# Altium project ZLS_MCU_New.PrjPCB (part 1 of 4)
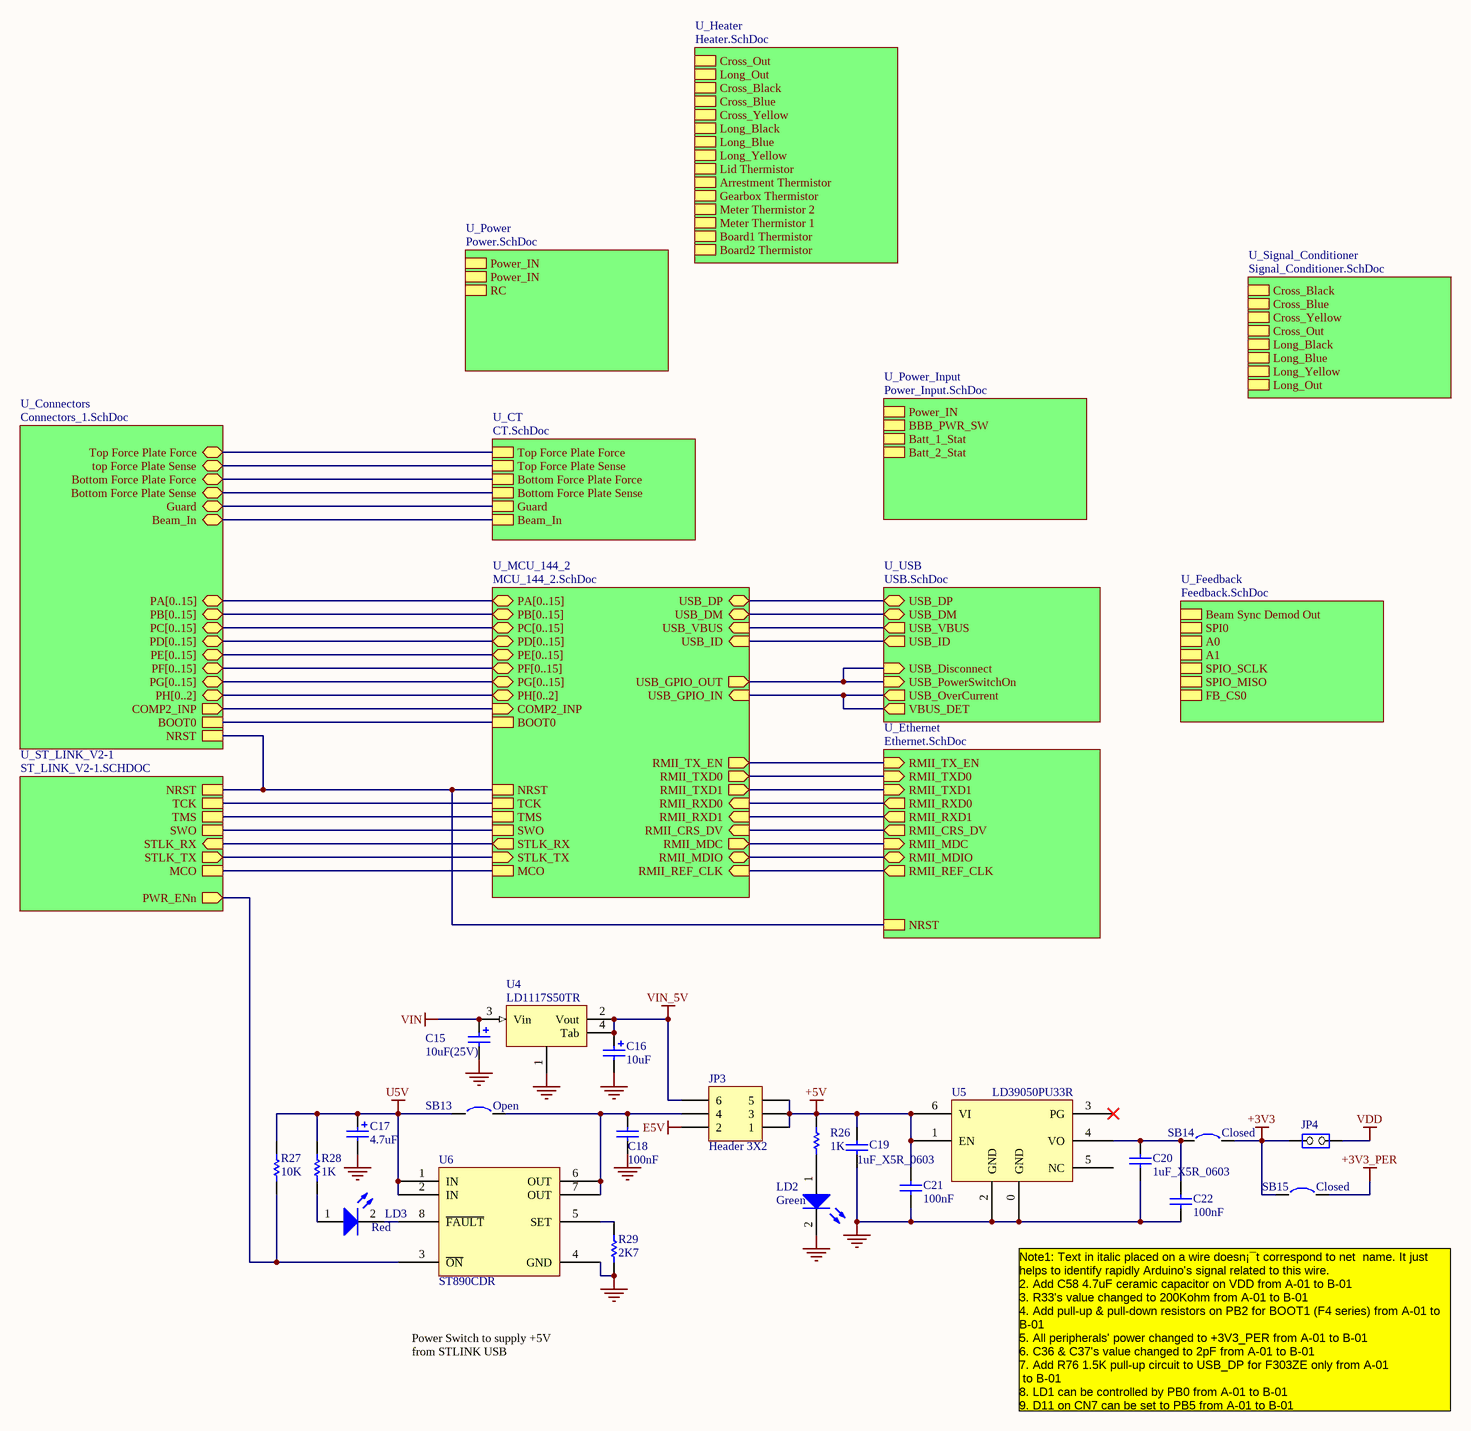
[diagram p0: Top.SchDoc]
11 sheets, 433 parts. Net scope: hierarchical (ports join the sheet entries above them; power ports are global).
Board file: ZLS_MCU.PcbDoc
Sheets:
  Top.SchDoc
    U_Connectors = Connectors_1.SchDoc
    U_MCU_144_2 = MCU_144_2.SchDoc
    U_Feedback = Feedback.SchDoc
    U_Power = Power.SchDoc
    U_Power_Input = Power_Input.SchDoc
    U_Signal_Conditioner = Signal_Conditioner.SchDoc
    U_Heater = Heater.SchDoc
    U_CT = CT.SchDoc
  Copy of USB.SchDoc
  Copy of ST_LINK_V2-1.SCHDOC

## Sheet Top.SchDoc: TOP & POWER
size Tabloid; DocumentNumber: MB1137; Revision: B-01; SheetNumber: 1; SheetTotal: 6; Project: NUCLEO-XXXXZX

### Parts
C15  10uF(25V)  [TAN-B]
C16  10uF  [TAN-A]
C17  4.7uF  [TAN-A]
C18  100nF  [0603C]
C19  1uF_X5R_0603  [0603C]
C20  1uF_X5R_0603  [0603C]
C21  100nF  [0603C]
C22  100nF  [0603C]
JP3  Header 3X2  [HDR_3x2_2R54_V_M]
JP4  (no value)  [HDR_1x2_2R54_V_M_S]
LD2  Green  [0603D-G]
LD3  Red  [0603D-R]
R26  1K  [0603R]
R27  10K  [0603R]
R28  1K  [0603R]
R29  2K7  [0603R]
SB13  Open  [SB_0603]
SB14  Closed  [SB_0603]
SB15  Closed  [SB_0603]
U4  LD1117S50TR  [SOT-223]
U5  LD39050PU33R  [DFN6_0R95_3x3_TP]
U6  ST890CDR  [SOIC8_1R27_4R9X6]

### Sub-sheets
U_Connectors = Connectors_1.SchDoc: PA[0..15] (bidir), PB[0..15] (bidir), PC[0..15] (bidir), NRST, BOOT0, PD[0..15] (bidir), PE[0..15] (bidir), PF[0..15] (bidir), PG[0..15] (bidir), PH[0..2] (bidir), COMP2_INP (out), Top Force Plate Force, top Force Plate Sense, Bottom Force Plate Force, Bottom Force Plate Sense, Guard, Beam_In
U_CT = CT.SchDoc: Top Force Plate Force, Top Force Plate Sense, Bottom Force Plate Force, Bottom Force Plate Sense, Guard, Beam_In
U_Ethernet = Ethernet.SchDoc (file not in this document): RMII_TXD0 (in), RMII_TX_EN (in), RMII_RXD0 (out), RMII_REF_CLK (out), RMII_CRS_DV (out), RMII_MDC (in), RMII_MDIO (bidir), NRST, RMII_TXD1 (in), RMII_RXD1 (out)
U_Feedback = Feedback.SchDoc: Beam Sync Demod Out, SPI0 (harness SPI0), A0, A1, SPIO_SCLK, SPIO_MISO, FB_CS0
U_Heater = Heater.SchDoc: Cross_Out, Long_Out, Cross_Black, Cross_Blue, Cross_Yellow, Long_Black, Long_Blue, Long_Yellow, Lid Thermistor, Arrestment Thermistor, Gearbox Thermistor, Meter Thermistor 2, Meter Thermistor 1, Board1 Thermistor, Board2 Thermistor
U_MCU_144_2 = MCU_144_2.SchDoc: NRST, MCO, STLK_TX (in), STLK_RX (out), PA[0..15] (bidir), PB[0..15] (bidir), PC[0..15] (bidir), TCK, TMS, SWO, BOOT0, PD[0..15] (bidir), PE[0..15] (bidir), PF[0..15] (bidir), PG[0..15] (bidir), PH[0..2] (bidir), USB_DM (bidir), USB_DP (bidir), USB_GPIO_OUT (out), USB_GPIO_IN (in), USB_ID (in), USB_VBUS (in), RMII_TXD0 (out), RMII_TX_EN (out), RMII_RXD0 (in), RMII_REF_CLK (in), RMII_CRS_DV (in), RMII_MDC (out), RMII_MDIO (bidir), RMII_TXD1 (out), RMII_RXD1 (in), COMP2_INP (in)
U_Power = Power.SchDoc: Power_IN, Power_IN, RC
U_Power_Input = Power_Input.SchDoc: Power_IN, BBB_PWR_SW, Batt_1_Stat, Batt_2_Stat
U_Signal_Conditioner = Signal_Conditioner.SchDoc: Cross_Black, Cross_Blue, Cross_Yellow, Cross_Out, Long_Black, Long_Blue, Long_Yellow, Long_Out
U_ST_LINK_V2-1 = ST_LINK_V2-1.SCHDOC (file not in this document): TMS, TCK, MCO, NRST, STLK_RX (in), STLK_TX (out), SWO, PWR_ENn (out)
U_USB = USB.SchDoc (file not in this document): USB_PowerSwitchOn (in), USB_OverCurrent (out), USB_DM (bidir), USB_DP (bidir), USB_ID (out), USB_VBUS (out), USB_Disconnect (in), VBUS_DET (out)

### Nets
+3V3: JP4.1(COMMON) SB14.2 SB15.1
+3V3_PER: SB15.2
+5V: C19.1 C21.2 JP3.1 JP3.3 JP3.5 R26.2 U5.1(EN) U5.6(VI)
E5V: JP3.2
GND: C15.2 C16.2 C17.2 C18.1 C19.2 C20.2 C21.1 C22.1 LD2.2(K) R29.1 U4.1 U5.0(GND) U5.2(GND) U6.4(GND)
U5V: C17.1 R27.1 R28.1 SB13.1 U6.1(IN) U6.2(IN)
VDD: JP4.2(NO)
VIN: C15.1 U4.3(Vin)
VIN_5V: C16.1 JP3.6 U4.2(Vout) U4.4(Tab)
Beam_In: sheet U_Connectors/Beam_In, sheet U_CT/Beam_In
BOOT0: sheet U_Connectors/BOOT0, sheet U_MCU_144_2/BOOT0
NRST: sheet U_Connectors/NRST, sheet U_ST_LINK_V2-1/NRST, sheet U_Ethernet/NRST, sheet U_MCU_144_2/NRST
PA13: sheet U_ST_LINK_V2-1/TMS, sheet U_MCU_144_2/TMS
PA14: sheet U_ST_LINK_V2-1/TCK, sheet U_MCU_144_2/TCK
PB3: sheet U_ST_LINK_V2-1/SWO, sheet U_MCU_144_2/SWO
PG6: sheet U_MCU_144_2/USB_GPIO_OUT, sheet U_USB/USB_PowerSwitchOn, sheet U_USB/USB_Disconnect
NetC18_2: C18.2 JP3.4 SB13.2 U6.6(OUT) U6.7(OUT)
NetC20_1: C20.1 C22.2 SB14.1 U5.4(VO)
NetC77_2: sheet U_Power/Power_IN, sheet U_Power/Power_IN
NetJ1_1: sheet U_Connectors/Top Force Plate Force, sheet U_CT/Top Force Plate Force
NetJ1_2: sheet U_Connectors/top Force Plate Sense, sheet U_CT/Top Force Plate Sense
NetJ1_3: sheet U_Connectors/Bottom Force Plate Force, sheet U_CT/Bottom Force Plate Force
NetJ1_4: sheet U_Connectors/Bottom Force Plate Sense, sheet U_CT/Bottom Force Plate Sense
NetJ1_9: sheet U_Connectors/Guard, sheet U_CT/Guard
NetJP41_2: sheet U_Connectors/COMP2_INP, sheet U_Ethernet/RMII_CRS_DV, sheet U_MCU_144_2/RMII_CRS_DV, sheet U_MCU_144_2/COMP2_INP
NetJP42_1: sheet U_Ethernet/RMII_TXD1, sheet U_MCU_144_2/RMII_TXD1
NetJP43_1: sheet U_MCU_144_2/USB_GPIO_IN, sheet U_USB/USB_OverCurrent, sheet U_USB/VBUS_DET
NetLD2_1: LD2.1(A) R26.1
NetLD3_1: LD3.1(A) R28.2
NetLD3_2: LD3.2(K) U6.8(~{FAULT})
NetR27_2: R27.2 U6.3(~{ON}) ; sheet U_ST_LINK_V2-1/PWR_ENn
NetR29_2: R29.2 U6.5(SET)
NetR46_1: sheet U_MCU_144_2/USB_VBUS, sheet U_USB/USB_VBUS
NetSB56_1: sheet U_Ethernet/RMII_REF_CLK, sheet U_MCU_144_2/RMII_REF_CLK
NetSB58_1: sheet U_Ethernet/RMII_MDIO, sheet U_MCU_144_2/RMII_MDIO
NetSB61_1: sheet U_ST_LINK_V2-1/STLK_RX, sheet U_MCU_144_2/STLK_RX
NetSB63_1: sheet U_ST_LINK_V2-1/STLK_TX, sheet U_MCU_144_2/STLK_TX
NetSB64_1: sheet U_MCU_144_2/USB_ID, sheet U_USB/USB_ID
NetSB65_1: sheet U_MCU_144_2/USB_DM, sheet U_USB/USB_DM
NetSB66_1: sheet U_MCU_144_2/USB_DP, sheet U_USB/USB_DP
NetSB68_1: sheet U_Ethernet/RMII_MDC, sheet U_MCU_144_2/RMII_MDC
NetSB69_1: sheet U_Ethernet/RMII_RXD0, sheet U_MCU_144_2/RMII_RXD0
NetSB70_1: sheet U_Ethernet/RMII_RXD1, sheet U_MCU_144_2/RMII_RXD1
NetSB72_2: sheet U_Ethernet/RMII_TX_EN, sheet U_MCU_144_2/RMII_TX_EN
NetSB73_2: sheet U_Ethernet/RMII_TXD0, sheet U_MCU_144_2/RMII_TXD0
NetSB74_1: sheet U_ST_LINK_V2-1/MCO, sheet U_MCU_144_2/MCO

Not connected (* = marked no-connect by the designer): U5 3(PG)* 5(NC)

### Buses and harness runs
bus sheet U_Connectors/PA[0..15] = sheet U_MCU_144_2/PA[0..15]
bus sheet U_Connectors/PB[0..15] = sheet U_MCU_144_2/PB[0..15]
bus sheet U_Connectors/PC[0..15] = sheet U_MCU_144_2/PC[0..15]
bus sheet U_Connectors/PD[0..15] = sheet U_MCU_144_2/PD[0..15]
bus sheet U_Connectors/PE[0..15] = sheet U_MCU_144_2/PE[0..15]
bus sheet U_Connectors/PF[0..15] = sheet U_MCU_144_2/PF[0..15]
bus sheet U_Connectors/PG[0..15] = sheet U_MCU_144_2/PG[0..15]
bus sheet U_Connectors/PH[0..2] = sheet U_MCU_144_2/PH[0..2]

### Notes on the sheet
- Power Switch to supply +5V from STLINK USB
- Note1: Text in italic placed on a wire doesn¡¯t correspond to net  name. It just helps to identify rapidly Arduino's signal related to this wire.
  2. Add C58 4.7uF ceramic capacitor on VDD from A-01 to B-01
  3. R33's value changed to 200Kohm from A-01 to B-01
  4. Add pull-up & pull-down resistors on PB2 for BOOT1 (F4 series) from A-01 to B-01
  5. All peripherals' power changed to +3V3_PER from A-01 to B-01
  6. C36 & C37's value changed to 2pF from A-01 to B-01
  7. Add R76 1.5K pull-up circuit to USB_DP for F303ZE only from A-01
  to B-01
  8. LD1 can be controlled by PB0 from A-01 to B-01
  9. D11 on CN7 can be set to PB5 from A-01 to B-01
- Title
- Size:
- Date:
- Tabloid
- Number:
- Time:
- Revision:
- Sheet
- of
- ZLS Corporation
- 7801 North Lamar Blvd.
- Suite E-184
- Austin, Texas 78752  USA
- (512) 453-0288
- File:

### Library data of the parts
C15 C16 = Cap Pol1: Polarized Capacitor (Radial); Published: 8-Jun-2000; Revision: July-2002: Re-released for DXP Platform.; Publisher: Altium Limited; Value: 10uF
C17 = Cap Pol1: Polarized Capacitor (Radial); Value: 100pF; Ordered by: Subcon; Published: 8-Jun-2000; Revision: July-2002: Re-released for DXP Platform.; Publisher: Altium Limited
C18 C21 C22 = Capacitor_ST: Capacitor 0402 / 0603 / 0805; Revision: July-2002: Re-released for DXP Platform.; Value: 100nF
C19 C20 = CAP SMD 0603  X5R 1µF 25V 10%: 0603  X5R 1µF; Rated voltage: 25V; Tolerance: 10%; Manufacturer: *; Manufacturer P/N: *; Order code Farnell: 1288202RL; Value: 1µF; Power: *; Technology: X5R; Temperature  Factor: *; Temperature Max: +125°C; Temperature Min: -55°C; STS Code: *
JP3 = Header 3X2: Header, 3-Pin, Dual row; Revision: 17-Jul-2002: Re-released for DXP Platform.; Publisher: Altium Limited
JP4 = JP2
LD2 LD3 = LED2: Typical RED, GREEN, YELLOW, AMBER GaAs LED; Published: 8-Jun-2000; Revision: July-2002: Re-released for DXP Platform.; Publisher: Altium Limited
R26 R29 = Resistor_ST: Resistor 0402 / 0603 / 0805; Value: 10K
R27 = Resistor_ST: Resistor 0402 / 0603 / 0805; Value: 10K
R28 = Res1: Resistor; Ordered by: Subcon; Published: 8-Jun-2000; Revision: July-2002: Re-released for DXP Platform.; Publisher: Altium Limited; Value: 1K
SB13 = Circuit Breaker: Published: 24-Mar-1999; Revision: July-2002: Re-released for DXP Platform.; Publisher: Altium Limited
SB14 SB15 = Circuit Breaker_close: Circuit Breaker; Published: 24-Mar-1999; Revision: July-2002: Re-released for DXP Platform.; Publisher: Altium Limited
U4 = LD1117
U5 = LD39050P

## Sheet Connectors_1.SchDoc: Extension connectors
size A3; DocumentNumber: MB1137; Revision: B-01; SheetNumber: 6; SheetTotal: 6; Project: NUCLEO-XXXXZX
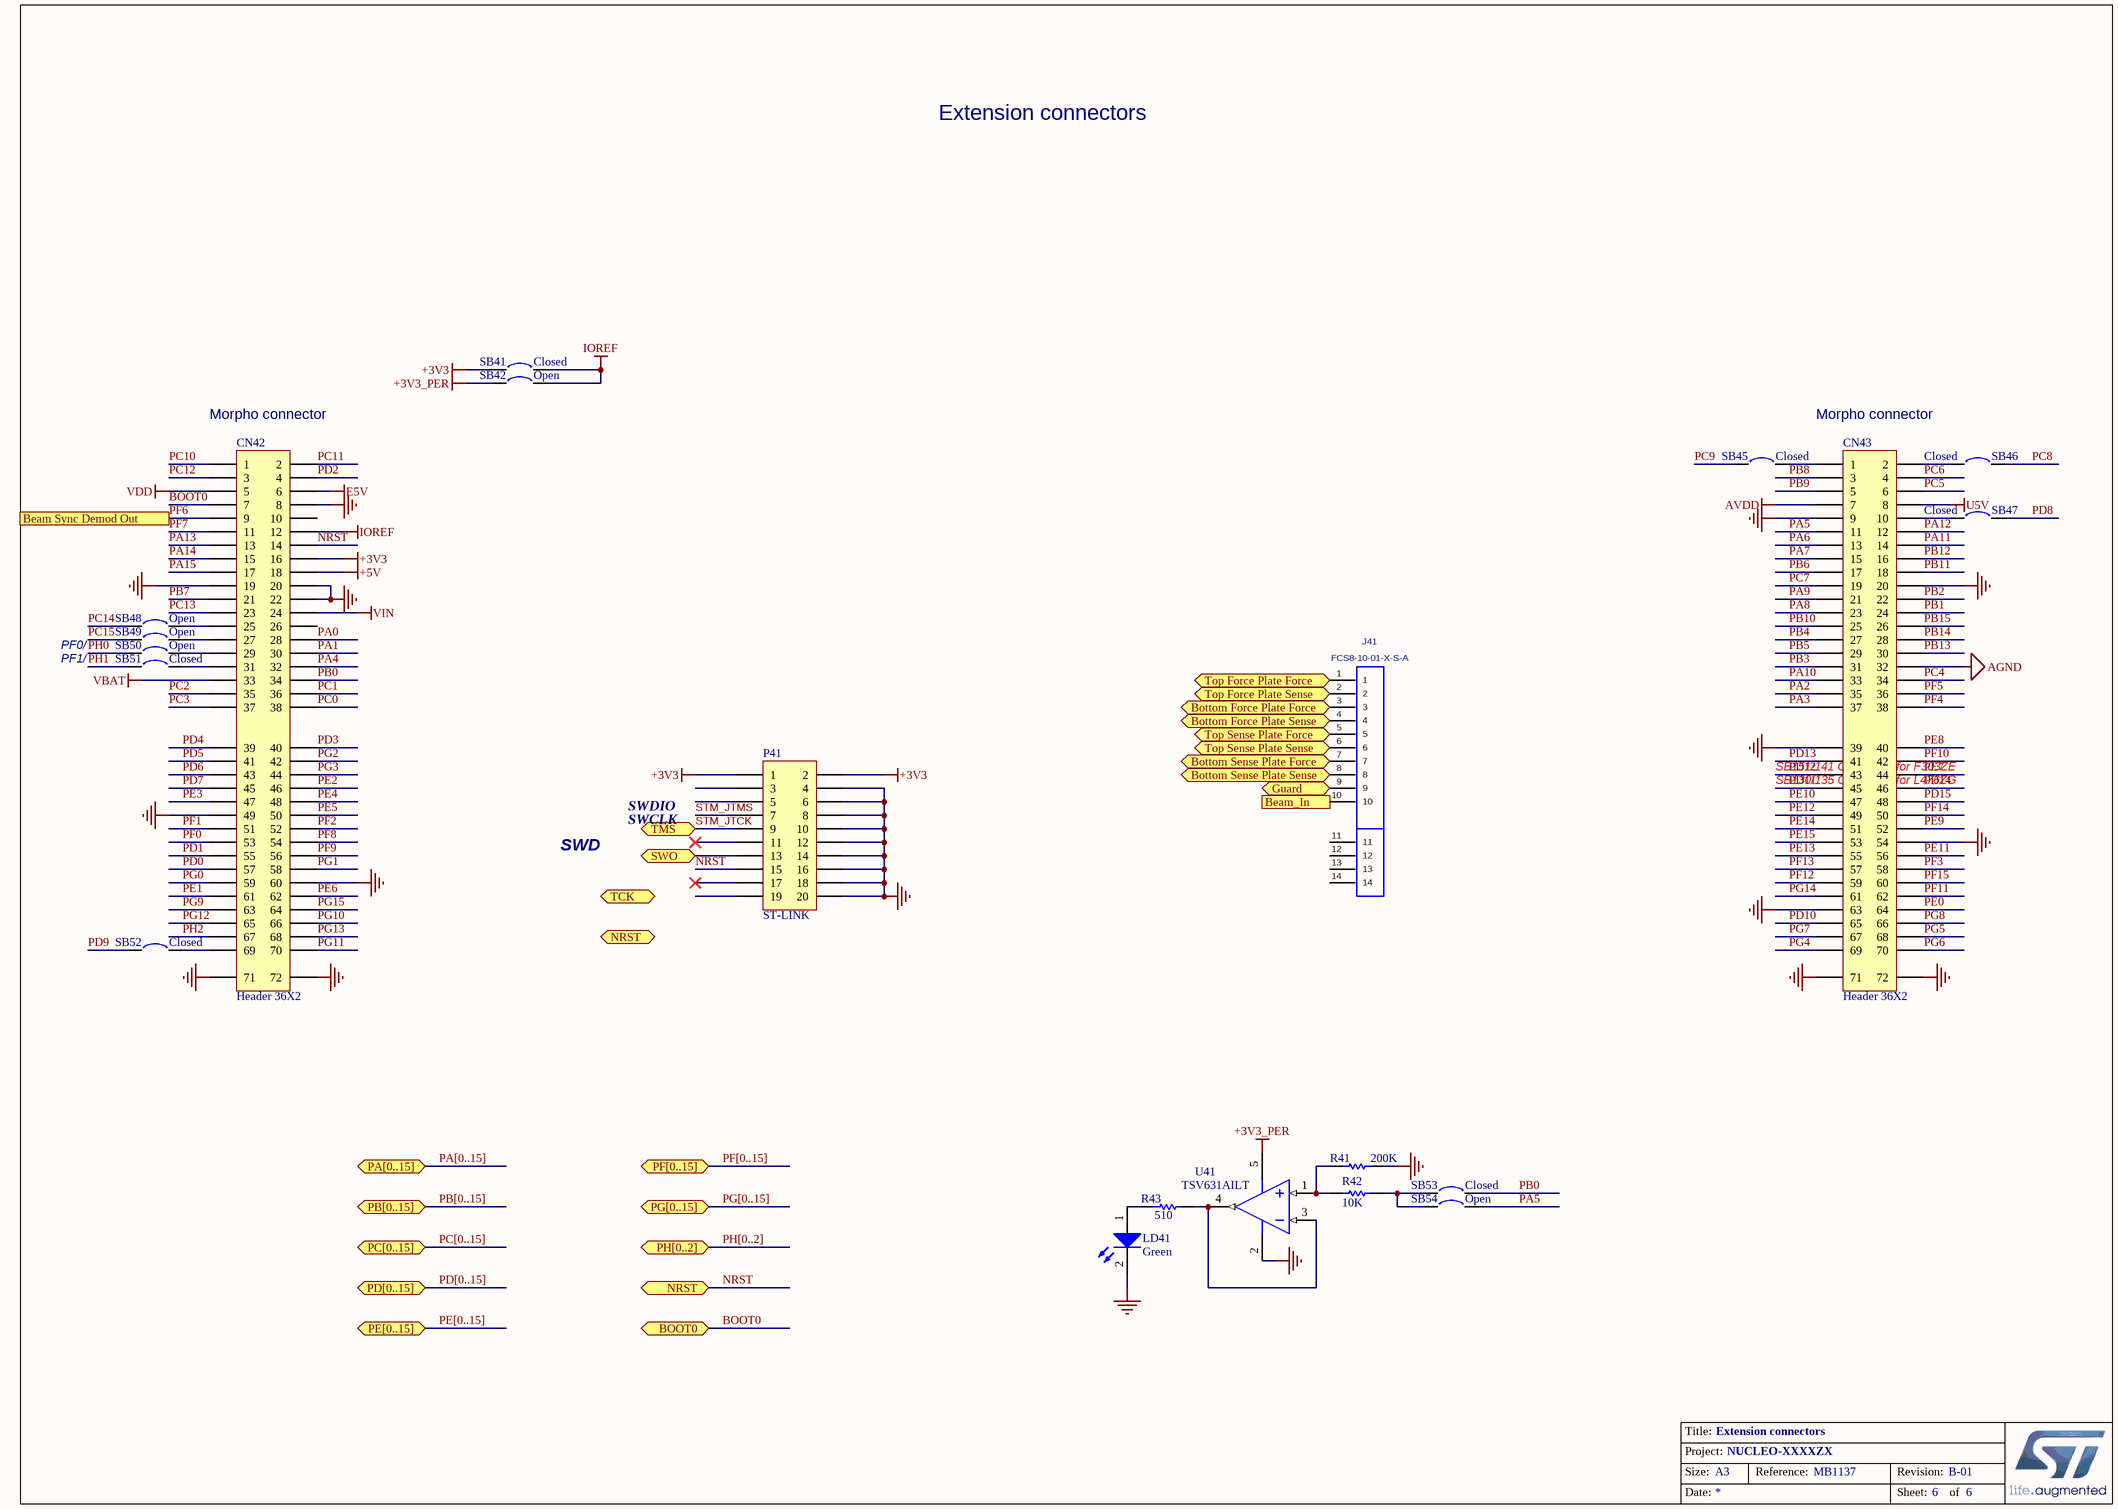
[diagram p1: Connectors_1.SchDoc]

### Parts
CN42  Header 36X2  [HDR_2x36_2R54_V_M]
CN43  Header 36X2  [HDR_2x36_2R54_V_M]
J41  FCS8-10-01-X-S-A  [FCS8-10-01-X-S-A]
LD41  Green  [0603D-G]
P41  ST-LINK  [HDR2X10]
R41  200K  [0603R]
R42  10K  [0603R]
R43  510  [0603R]
SB41  Closed  [SB_0603]
SB42  Open  [SB_0603]
SB45  Closed  [SB_0603]
SB46  Closed  [SB_0603]
SB47  Closed  [SB_0603]
SB48  Open  [SB_0603]
SB49  Open  [SB_0603]
SB50  Open  [SB_0603]
SB51  Closed  [SB_0603]
SB52  Closed  [SB_0603]
SB53  Closed  [SB_0603]
SB54  Open  [SB_0603]
U41  TSV631AILT  [SOT-23-5L]

### Ports
Beam Sync Demod Out, Beam_In, BOOT0, Bottom Force Plate Force, Bottom Force Plate Sense, Bottom Sense Plate Force, Bottom Sense Plate Sense, Guard, NRST, PA[0..15] (bidir), PB[0..15] (bidir), PC[0..15] (bidir), PD[0..15] (bidir), PE[0..15] (bidir), PF[0..15] (bidir), PG[0..15] (bidir), PH[0..2] (bidir), SWO, TCK, TMS, Top Force Plate Force, Top Force Plate Sense, Top Sense Plate Force, Top Sense Plate Sense

### Nets
+3V3: CN42.16 P41.1 P41.2 SB41.1
+3V3_PER: SB42.1 U41.5(VCC)
+5V: CN42.18
AGND: CN43.32
AVDD: CN43.7
E5V: CN42.6
GND: CN42.8 CN42.19 CN42.20 CN42.22 CN42.49 CN42.60 CN42.71 CN42.72 CN43.9 CN43.20 CN43.39 CN43.54 CN43.63 CN43.71 CN43.72 LD41.2(K) P41.4 P41.6 P41.8 P41.10 P41.12 P41.14 P41.16 P41.18 P41.20 R41.2 U41.2(VDD)
IOREF: CN42.12 SB41.2 SB42.2
U5V: CN43.8
VBAT: CN42.33
VDD: CN42.5
VIN: CN42.24
Beam_In: J41.10 ; port Beam_In
BOOT0: CN42.7 ; port BOOT0
NRST: CN42.14 P41.15 ; port NRST
PA0: CN42.28
PA1: CN42.30
PA2: CN43.35
PA3: CN43.37
PA4: CN42.32
PA5: CN43.11 SB54.2
PA6: CN43.13
PA7: CN43.15
PA8: CN43.23
PA9: CN43.21
PA10: CN43.33
PA11: CN43.14
PA12: CN43.12
PA13: CN42.13
PA14: CN42.15
PA15: CN42.17
PB0: CN42.34 SB53.1
PB1: CN43.24
PB2: CN43.22
PB3: CN43.31
PB4: CN43.27
PB5: CN43.29
PB6: CN43.17
PB7: CN42.21
PB8: CN43.3
PB9: CN43.5
PB10: CN43.25
PB11: CN43.18
PB12: CN43.16
PB13: CN43.30
PB14: CN43.28
PB15: CN43.26
PC0: CN42.38
PC1: CN42.36
PC2: CN42.35
PC3: CN42.37
PC4: CN43.34
PC5: CN43.6
PC6: CN43.4
PC7: CN43.19
PC8: SB46.1
PC9: SB45.1
PC10: CN42.1
PC11: CN42.2
PC12: CN42.3
PC13: CN42.23
PC14: SB48.1
PC15: SB49.1
PD0: CN42.57
PD1: CN42.55
PD2: CN42.4
PD3: CN42.40
PD4: CN42.39
PD5: CN42.41
PD6: CN42.43
PD7: CN42.45
PD8: SB47.2
PD9: SB52.1
PD10: CN43.65
PD11: CN43.45
PD12: CN43.43
PD13: CN43.41
PD14: CN43.46
PD15: CN43.48
PE0: CN43.64
PE1: CN42.61
PE2: CN42.46
PE3: CN42.47
PE4: CN42.48
PE5: CN42.50
PE6: CN42.62
PE7: CN43.44
PE8: CN43.40
PE9: CN43.52
PE10: CN43.47
PE11: CN43.56
PE12: CN43.49
PE13: CN43.55
PE14: CN43.51
PE15: CN43.53
PF0: CN42.53
PF1: CN42.51
PF2: CN42.52
PF3: CN43.58
PF4: CN43.38
PF5: CN43.36
PF6: CN42.9 ; port Beam Sync Demod Out
PF7: CN42.11
PF8: CN42.54
PF9: CN42.56
PF10: CN43.42
PF11: CN43.62
PF12: CN43.59
PF13: CN43.57
PF14: CN43.50
PF15: CN43.60
PG0: CN42.59
PG1: CN42.58
PG2: CN42.42
PG3: CN42.44
PG4: CN43.69
PG5: CN43.68
PG6: CN43.70
PG7: CN43.67
PG8: CN43.66
PG9: CN42.63
PG10: CN42.66
PG11: CN42.70
PG12: CN42.65
PG13: CN42.68
PG14: CN43.61
PG15: CN42.64
PH0: SB50.1
PH1: SB51.1
PH2: CN42.67
STM_JTCK: P41.9 ; port TMS
STM_JTMS: P41.7
NetCN42_25: CN42.25 SB48.2
NetCN42_27: CN42.27 SB49.2
NetCN42_29: CN42.29 SB50.2
NetCN42_31: CN42.31 SB51.2
NetCN42_69: CN42.69 SB52.2
NetCN43_1: CN43.1 SB45.2
NetCN43_2: CN43.2 SB46.2
NetCN43_10: CN43.10 SB47.1
NetJ1_1: J41.1 ; port Top Force Plate Force
NetJ1_2: J41.2 ; port Top Force Plate Sense
NetJ1_3: J41.3 ; port Bottom Force Plate Force
NetJ1_4: J41.4 ; port Bottom Force Plate Sense
NetJ1_9: J41.9 ; port Guard
NetJ41_5: J41.5 ; port Top Sense Plate Force
NetJ41_6: J41.6 ; port Top Sense Plate Sense
NetJ41_7: J41.7 ; port Bottom Sense Plate Force
NetJ41_8: J41.8 ; port Bottom Sense Plate Sense
NetLD41_1: LD41.1(A) R43.2
NetP41_13: P41.13 ; port SWO
NetR41_1: R41.1 R42.1 U41.1(IN+)
NetR42_2: R42.2 SB53.2 SB54.1
NetR43_1: R43.1 U41.3(IN-) U41.4(OUT)

Not connected (* = marked no-connect by the designer): CN42 10 26; J41 11 12 13 14; P41 3 5 11* 17* 19

### Buses and harness runs
bus PA[0..15] = port PA[0..15]
bus PB[0..15] = port PB[0..15]
bus PC[0..15] = port PC[0..15]
bus PD[0..15] = port PD[0..15]
bus PE[0..15] = port PE[0..15]
bus PF[0..15] = port PF[0..15]
bus PG[0..15] = port PG[0..15]
bus PH[0..2] = port PH[0..2]

### Notes on the sheet
- Extension connectors
- (near CN42) Morpho connector
- Morpho connector
- PF0/
- PF1/
- SB151/141 Close only for F303ZE
- SB130/135 Close only for L476ZG
- (near CN42) /PH1
- (near CN42) /PH0
- SWD
- SWCLK
- SWDIO
- Title:
- Project:
- Size:
- Date:
- A3
- Reference:
- Sheet:
- Revision:
- of

### Library data of the parts
CN42 CN43 = Header 36X2: Header, 36-Pin, Dual row; Revision: 17-Jul-2002: Re-released for DXP Platform.; Publisher: Altium Limited
J41 = FCS8-10-01-X-S-A: FCS8 Socket Assembly, 20-Pins, w/ Alignment Pins; MANUFACTURER: SAMTEC; CREATED: 31 NOV 2013 - WENDY XIN; PCB DECAL: FCS8-10-01-X-S-A
LD41 = LED2: as LD2 on sheet Top; Published: 8-Jun-2000; Revision: July-2002: Re-released for DXP Platform.; Publisher: Altium Limited
P41 = Header 10X2: Header, 10-Pin, Dual row; LatestRevisionDate: 17-Jul-2002; LatestRevisionNote: Re-released for DXP Platform.; Publisher: Altium Limited
R41 R42 = res1: Resistor; Value: 1K; Published: 8-Jun-2000; Revision: July-2002: Re-released for DXP Platform.; Publisher: Altium Limited
R43 = Res1: Resistor; Value: 1K; Published: 8-Jun-2000; Revision: July-2002: Re-released for DXP Platform.; Publisher: Altium Limited
SB41 SB45-SB47 SB51-SB53 = Circuit Breaker_close: Circuit Breaker; Published: 24-Mar-1999; Revision: July-2002: Re-released for DXP Platform.; Publisher: Altium Limited
SB42 SB48-SB50 SB54 = Circuit Breaker: Published: 24-Mar-1999; Revision: July-2002: Re-released for DXP Platform.; Publisher: Altium Limited

## Sheet MCU_144_2.SchDoc: MCU
size A3; DocumentNumber: MB1137; Revision: B-01; SheetNumber: 2; SheetTotal: 6; Project: NUCLEO-XXXXZX
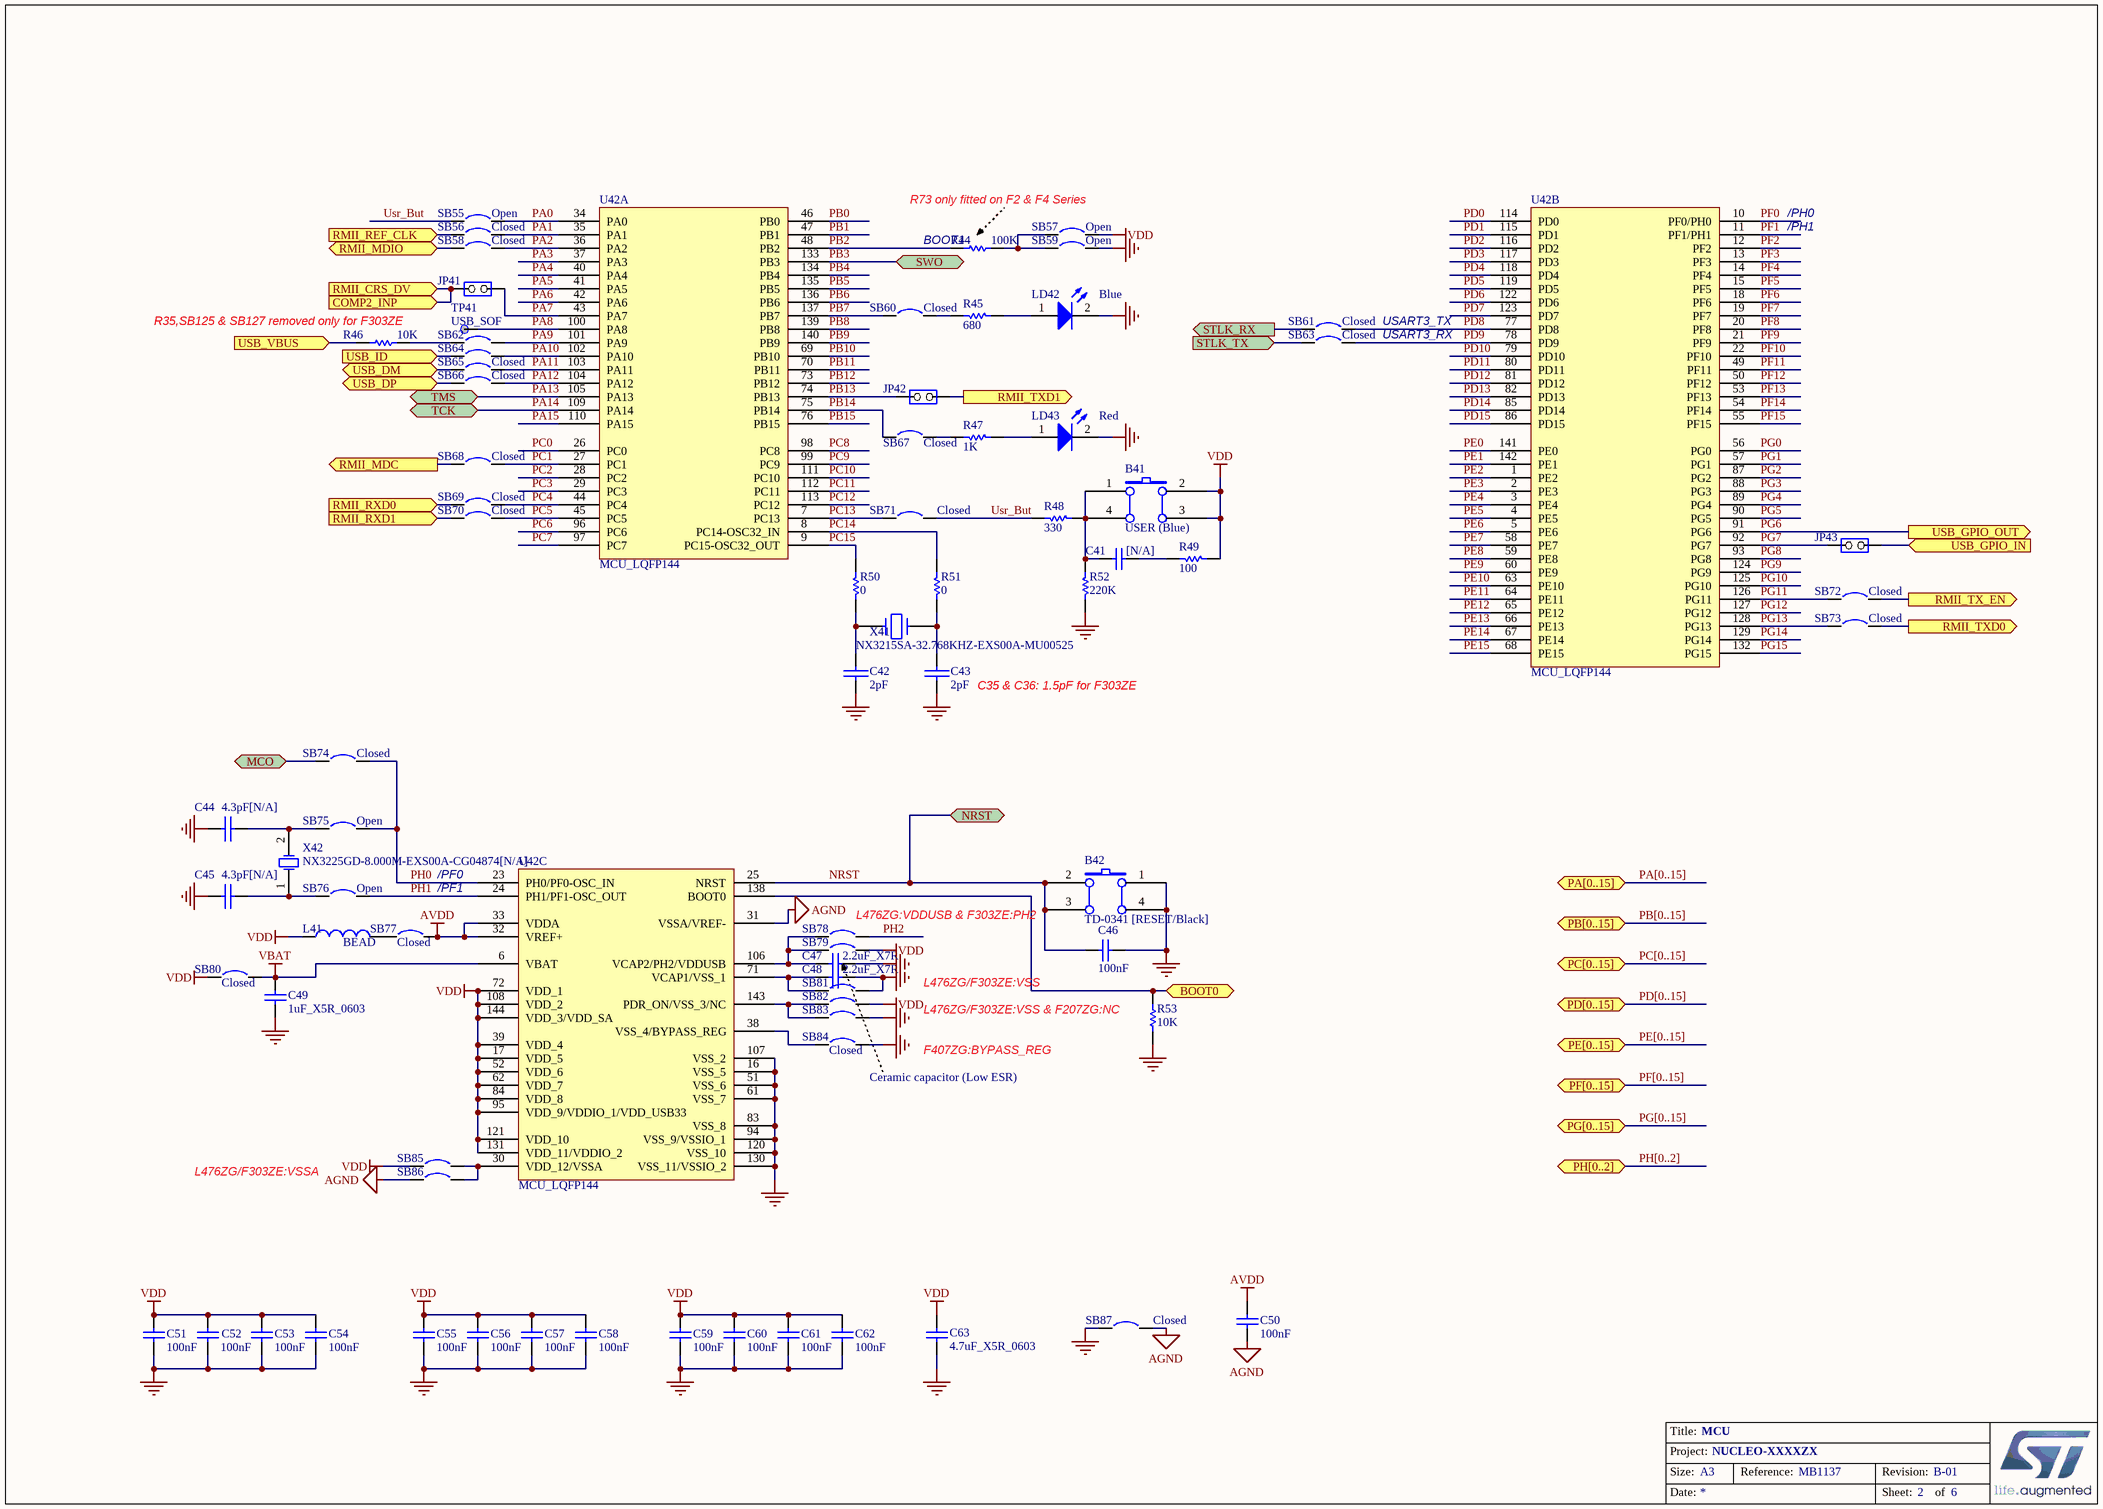
[diagram p2: MCU_144_2.SchDoc]

### Parts
B41  USER (Blue)  [PB-6X6mm-Blue]
B42  TD-0341 [RESET/Black]  [PB-6X6mm-Black]
C41  [N/A]  [0603C]
C42  2pF  [0603C]
C43  2pF  [0603C]
C44  4.3pF[N/A]  [0603C]
C45  4.3pF[N/A]  [0603C]
C46  100nF  [0603C]
C47  2.2uF_X7R  [TAN-A]
C48  2.2uF_X7R  [TAN-A]
C49  1uF_X5R_0603  [0603C]
C50  100nF  [0603C]
C51  100nF  [0603C]
C52  100nF  [0603C]
C53  100nF  [0603C]
C54  100nF  [0603C]
C55  100nF  [0603C]
C56  100nF  [0603C]
C57  100nF  [0603C]
C58  100nF  [0603C]
C59  100nF  [0603C]
C60  100nF  [0603C]
C61  100nF  [0603C]
C62  100nF  [0603C]
C63  4.7uF_X5R_0603  [0603C]
JP41  (no value)  [HDR_1x2_2R54_V_M_S]
JP42  (no value)  [HDR_1x2_2R54_V_M_S]
JP43  (no value)  [HDR_1x2_2R54_V_M_S]
L41  BEAD  [0603L]
LD42  Blue  [0603D-B]
LD43  Red  [0603D-R]
R44  100K  [0603R]
R45  680  [0603R]
R46  10K  [0603R]
R47  1K  [0603R]
R48  330  [0603R]
R49  100  [0603R]
R50  0  [0603R]
R51  0  [0603R]
R52  220K  [0603R]
R53  10K  [0603R]
SB55  Open  [SB_0603]
SB56  Closed  [SB_0603]
SB57  Open  [SB_0603]
SB58  Closed  [SB_0603]
SB59  Open  [SB_0603]
SB60  Closed  [SB_0603]
SB61  Closed  [SB_0603]
SB62  Circuit Breaker  [SB_0603]  (value not drawn)
SB63  Closed  [SB_0603]
SB64  Circuit Breaker  [SB_0603]  (value not drawn)
SB65  Closed  [SB_0603]
SB66  Closed  [SB_0603]
SB67  Closed  [SB_0603]
SB68  Closed  [SB_0603]
SB69  Closed  [SB_0603]
SB70  Closed  [SB_0603]
SB71  Closed  [SB_0603]
SB72  Closed  [SB_0603]
SB73  Closed  [SB_0603]
SB74  Closed  [SB_0603]
SB75  Open  [SB_0603]
SB76  Open  [SB_0603]
SB77  Closed  [SB_0603]
SB78  Circuit Breaker  [SB_0603]  (value not drawn)
SB79  Circuit Breaker  [SB_0603]  (value not drawn)
SB80  Closed  [SB_0603]
SB81  Circuit Breaker  [SB_0603]  (value not drawn)
SB82  Circuit Breaker  [SB_0603]  (value not drawn)
SB83  Circuit Breaker  [SB_0603]  (value not drawn)
SB84  Closed  [SB_0603]
SB85  Circuit Breaker  [SB_0603]  (value not drawn)
SB86  Circuit Breaker  [SB_0603]  (value not drawn)
SB87  Closed  [SB_0603]
TP41  USB_SOF  [TP]
U42  MCU_LQFP144  [LQFP144_0R5_SKT]  (parts A,B,C of 3)
X41  NX3215SA-32.768KHZ-EXS00A-MU00525  [XTAL_2SM_3R2X1R5]
X42  NX3225GD-8.000M-EXS00A-CG04874[N/A]  [OSC_2SM_3R2x2R5]

### Ports
BOOT0, COMP2_INP (in), MCO, NRST, PA[0..15] (bidir), PB[0..15] (bidir), PC[0..15] (bidir), PD[0..15] (bidir), PE[0..15] (bidir), PF[0..15] (bidir), PG[0..15] (bidir), PH[0..2] (bidir), RMII_CRS_DV (in), RMII_MDC (out), RMII_MDIO (bidir), RMII_REF_CLK (in), RMII_RXD0 (in), RMII_RXD1 (in), RMII_TX_EN (out), RMII_TXD0 (out), RMII_TXD1 (out), STLK_RX (out), STLK_TX (in), SWO, TCK, TMS, USB_DM (bidir), USB_DP (bidir), USB_GPIO_IN (in), USB_GPIO_OUT (out), USB_ID (in), USB_VBUS (in)

### Nets
AGND: C50.2 SB86.1 SB87.2 U42.31(VSSA/VREF-)
AVDD: C50.1 SB77.2 U42.32(VREF+) U42.33(VDDA)
GND: B42.1(A0) B42.4(A1) C42.2 C43.2 C44.2 C45.2 C46.1 C47.2 C48.2 C49.2 C51.2 C52.2 C53.2 C54.2 C55.2 C56.2 C57.2 C58.2 C59.2 C60.2 C61.2 C62.2 C63.2 LD42.2(K) LD43.2(K) R52.2 R53.2 SB59.2 SB81.2 SB83.2 SB84.2 SB87.1 U42.16(VSS_5) U42.51(VSS_6) U42.61(VSS_7) U42.83(VSS_8) U42.94(VSS_9/VSSIO_1) U42.107(VSS_2) U42.120(VSS_10) U42.130(VSS_11/VSSIO_2)
VBAT: C49.1 SB80.2 U42.6(VBAT)
VDD: B41.2(B0) B41.3(B1) C51.1 C52.1 C53.1 C54.1 C55.1 C56.1 C57.1 C58.1 C59.1 C60.1 C61.1 C62.1 C63.1 L41.1 R49.1 SB57.2 SB79.2 SB80.1 SB82.2 SB85.1 U42.17(VDD_5) U42.39(VDD_4) U42.52(VDD_6) U42.62(VDD_7) U42.72(VDD_1) U42.84(VDD_8) U42.95(VDD_9/VDDIO_1/VDD_USB33) U42.108(VDD_2) U42.121(VDD_10) U42.131(VDD_11/VDDIO_2) U42.144(VDD_3/VDD_SA)
BOOT0: R53.1 U42.138(BOOT0) ; port BOOT0
NRST: B42.2(B0) B42.3(B1) C46.2 U42.25(NRST) ; port NRST
PA0: SB55.2 U42.34(PA0)
PA1: SB56.2 U42.35(PA1)
PA2: SB58.2 U42.36(PA2)
PA3: U42.37(PA3)
PA4: U42.40(PA4)
PA5: U42.41(PA5)
PA6: U42.42(PA6)
PA7: JP41.1(COMMON) U42.43(PA7)
PA8: TP41.1 U42.100(PA8)
PA9: SB62.2 U42.101(PA9)
PA10: SB64.2 U42.102(PA10)
PA11: SB65.2 U42.103(PA11)
PA12: SB66.2 U42.104(PA12)
PA13: U42.105(PA13) ; port TMS
PA14: U42.109(PA14) ; port TCK
PA15: U42.110(PA15)
PB0: U42.46(PB0)
PB1: U42.47(PB1)
PB2: R44.1 U42.48(PB2)
PB3: U42.133(PB3) ; port SWO
PB4: U42.134(PB4)
PB5: U42.135(PB5)
PB6: U42.136(PB6)
PB7: SB60.1 U42.137(PB7)
PB8: U42.139(PB8)
PB9: U42.140(PB9)
PB10: U42.69(PB10)
PB11: U42.70(PB11)
PB12: U42.73(PB12)
PB13: JP42.2(NO) U42.74(PB13)
PB14: SB67.1 U42.75(PB14)
PB15: U42.76(PB15)
PC0: U42.26(PC0)
PC1: SB68.2 U42.27(PC1)
PC2: U42.28(PC2)
PC3: U42.29(PC3)
PC4: SB69.2 U42.44(PC4)
PC5: SB70.2 U42.45(PC5)
PC6: U42.96(PC6)
PC7: U42.97(PC7)
PC8: U42.98(PC8)
PC9: U42.99(PC9)
PC10: U42.111(PC10)
PC11: U42.112(PC11)
PC12: U42.113(PC12)
PC13: SB71.1 U42.7(PC13)
PC14: R51.2 U42.8(PC14-OSC32_IN)
PC15: R50.2 U42.9(PC15-OSC32_OUT)
PD0: U42.114(PD0)
PD1: U42.115(PD1)
PD2: U42.116(PD2)
PD3: U42.117(PD3)
PD4: U42.118(PD4)
PD5: U42.119(PD5)
PD6: U42.122(PD6)
PD7: U42.123(PD7)
PD8: SB61.2 U42.77(PD8)
PD9: SB63.2 U42.78(PD9)
PD10: U42.79(PD10)
PD11: U42.80(PD11)
PD12: U42.81(PD12)
PD13: U42.82(PD13)
PD14: U42.85(PD14)
PD15: U42.86(PD15)
PE0: U42.141(PE0)
PE1: U42.142(PE1)
PE2: U42.1(PE2)
PE3: U42.2(PE3)
PE4: U42.3(PE4)
PE5: U42.4(PE5)
PE6: U42.5(PE6)
PE7: U42.58(PE7)
PE8: U42.59(PE8)
PE9: U42.60(PE9)
PE10: U42.63(PE10)
PE11: U42.64(PE11)
PE12: U42.65(PE12)
PE13: U42.66(PE13)
PE14: U42.67(PE14)
PE15: U42.68(PE15)
PF0: U42.10(PF0/PH0)
PF1: U42.11(PF1/PH1)
PF2: U42.12(PF2)
PF3: U42.13(PF3)
PF4: U42.14(PF4)
PF5: U42.15(PF5)
PF6: U42.18(PF6)
PF7: U42.19(PF7)
PF8: U42.20(PF8)
PF9: U42.21(PF9)
PF10: U42.22(PF10)
PF11: U42.49(PF11)
PF12: U42.50(PF12)
PF13: U42.53(PF13)
PF14: U42.54(PF14)
PF15: U42.55(PF15)
PG0: U42.56(PG0)
PG1: U42.57(PG1)
PG2: U42.87(PG2)
PG3: U42.88(PG3)
PG4: U42.89(PG4)
PG5: U42.90(PG5)
PG6: U42.91(PG6) ; port USB_GPIO_OUT
PG7: JP43.2(NO) U42.92(PG7)
PG8: U42.93(PG8)
PG9: U42.124(PG9)
PG10: U42.125(PG10)
PG11: SB72.1 U42.126(PG11)
PG12: U42.127(PG12)
PG13: SB73.1 U42.128(PG13)
PG14: U42.129(PG14)
PG15: U42.132(PG15)
PH0: SB74.2 SB75.2 U42.23(PH0/PF0-OSC_IN)
PH1: SB76.2 U42.24(PH1/PF1-OSC_OUT)
PH2: SB78.2
Usr_But: R48.2 SB55.1 SB71.2
NetB41_1: B41.1(A0) B41.4(A1) C41.2 R48.1 R52.1
NetC41_1: C41.1 R49.2
NetC42_1: C42.1 R50.1 X41.1
NetC43_1: C43.1 R51.1 X41.2
NetC44_1: C44.1 SB75.1 X42.2(OSC2)
NetC45_1: C45.1 SB76.1 X42.1(OSC1)
NetC47_1: C47.1 SB78.1 SB79.1 U42.106(VCAP2/PH2/VDDUSB)
NetC48_1: C48.1 SB81.1 U42.71(VCAP1/VSS_1)
NetJP41_2: JP41.2(NO) ; port RMII_CRS_DV, port COMP2_INP
NetJP42_1: JP42.1(COMMON) ; port RMII_TXD1
NetJP43_1: JP43.1(COMMON) ; port USB_GPIO_IN
NetL41_2: L41.2 SB77.1
NetLD42_1: LD42.1(A) R45.2
NetLD43_1: LD43.1(A) R47.2
NetR44_2: R44.2 SB57.1 SB59.1
NetR45_1: R45.1 SB60.2
NetR46_1: R46.1 ; port USB_VBUS
NetR46_2: R46.2 SB62.1
NetR47_1: R47.1 SB67.2
NetSB56_1: SB56.1 ; port RMII_REF_CLK
NetSB58_1: SB58.1 ; port RMII_MDIO
NetSB61_1: SB61.1 ; port STLK_RX
NetSB63_1: SB63.1 ; port STLK_TX
NetSB64_1: SB64.1 ; port USB_ID
NetSB65_1: SB65.1 ; port USB_DM
NetSB66_1: SB66.1 ; port USB_DP
NetSB68_1: SB68.1 ; port RMII_MDC
NetSB69_1: SB69.1 ; port RMII_RXD0
NetSB70_1: SB70.1 ; port RMII_RXD1
NetSB72_2: SB72.2 ; port RMII_TX_EN
NetSB73_2: SB73.2 ; port RMII_TXD0
NetSB74_1: SB74.1 ; port MCO
NetSB82_1: SB82.1 SB83.1 U42.143(PDR_ON/VSS_3/NC)
NetSB84_1: SB84.1 U42.38(VSS_4/BYPASS_REG)
NetSB85_2: SB85.2 SB86.2 U42.30(VDD_12/VSSA)

### Buses and harness runs
bus PA[0..15] = port PA[0..15]
bus PB[0..15] = port PB[0..15]
bus PC[0..15] = port PC[0..15]
bus PD[0..15] = port PD[0..15]
bus PE[0..15] = port PE[0..15]
bus PF[0..15] = port PF[0..15]
bus PG[0..15] = port PG[0..15]
bus PH[0..2] = port PH[0..2]

### Notes on the sheet
- R73 only fitted on F2 & F4 Series
- (near R44) BOOT1
- /PH0
- /PH1
- (near R46) R35,SB125 & SB127 removed only for F303ZE
- USART3_TX
- USART3_RX
- (near C43) C35 & C36: 1.5pF for F303ZE
- /PF0
- /PF1
- (near SB78) L476ZG:VDDUSB & F303ZE:PH2
- L476ZG/F303ZE:VSS
- L476ZG/F303ZE:VSS & F207ZG:NC
- F407ZG:BYPASS_REG
- (near SB84) Ceramic capacitor (Low ESR)
- L476ZG/F303ZE:VSSA
- Title:
- Project:
- Size:
- Date:
- A3
- Reference:
- Sheet:
- Revision:
- of

### Library data of the parts
B41 B42 = SW PUSHBUTTON: SE PUSHBUTTON
C41 C46 = CAP: Capacitor; Value: 100pF; Published: 8-Jun-2000; Revision: July-2002: Re-released for DXP Platform.; Publisher: Altium Limited
C42-C45 = CAP: Capacitor
C47 C48 = Cap_2.2uF_X7R_10%_0805: Capacitor,2.2uF,16V, X7R,10%,0805,YAGEO; Manuf_Part_1: CC0805KKX7R7BB225; Revision: July-2002: Re-released for DXP Platform.; Value: 2.2uF; Order: CC0805KKX7R7BB225; Manuf_1: YAGEO
C49 = CAP SMD 0603  X5R 1µF 25V 10%: as C19 on sheet Top; Manufacturer: *; Manufacturer P/N: *; Order code Farnell: 1288202RL; Value: 1µF; Power: *; Technology: X5R; Temperature  Factor: *; Temperature Max: +125°C; Temperature Min: -55°C; STS Code: *
C50-C62 = Cap: Capacitor; Value: 10nF; Published: 8-Jun-2000; Revision: July-2002: Re-released for DXP Platform.; Publisher: Altium Limited
C63 = CAP SMD 0603  X5R 1µF 25V 10%: 0603  X5R 4.7uF; Value: 1µF; Rated voltage: 25V; Tolerance: 10%; Manufacturer: *; Manufacturer P/N: *; Order code Farnell: 1288202RL; Power: *; Technology: X5R; Temperature  Factor: *; Temperature Max: +125°C; Temperature Min: -55°C; STS Code: *
JP41-JP43 = JP2
L41 = Inductor: Value: 100uH; Published: 8-Jun-2000; Revision: July-2002: Re-released for DXP Platform.; Publisher: Altium Limited
LD42 LD43 = LED2: as LD2 on sheet Top; Published: 8-Jun-2000; Revision: July-2002: Re-released for DXP Platform.; Publisher: Altium Limited
R44 R52 R53 = res1: Resistor; Value: 1K; Published: 8-Jun-2000; Revision: July-2002: Re-released for DXP Platform.; Publisher: Altium Limited
R45 R48-R51 = Res1: Resistor; Value: 1K; Published: 8-Jun-2000; Revision: July-2002: Re-released for DXP Platform.; Publisher: Altium Limited
R46 = Resistor_ST: Resistor 0402 / 0603 / 0805; Value: 10K
R47 = Res1: Resistor; Published: 8-Jun-2000; Revision: July-2002: Re-released for DXP Platform.; Publisher: Altium Limited; Value: 1K
SB55 SB57 SB59 SB75 SB76 = Circuit Breaker: Published: 24-Mar-1999; Revision: July-2002: Re-released for DXP Platform.; Publisher: Altium Limited
SB56 SB58 SB60 SB61 SB63 SB65-SB74 SB77 SB80 SB84 SB87 = Circuit Breaker_close: Circuit Breaker; Published: 24-Mar-1999; Revision: July-2002: Re-released for DXP Platform.; Publisher: Altium Limited
SB62 SB64 SB78 SB79 SB81-SB83 SB85 SB86 = Circuit Breaker: Solder: NO; Published: 24-Mar-1999; Revision: July-2002: Re-released for DXP Platform.; Publisher: Altium Limited
TP41 = TP
X41 = CRYSTAL_32K: Crystal
X42 = XTAL: Crystal Oscillator; Published: 8-Jun-2000; LatestRevisionDate: 17-Jul-2002; LatestRevisionNote: Re-released for DXP Platform.; PackageReference: R38; Publisher: Altium Limited